# EAGLE design display_board_ATMega4809 (EAGLE 9.6.2)
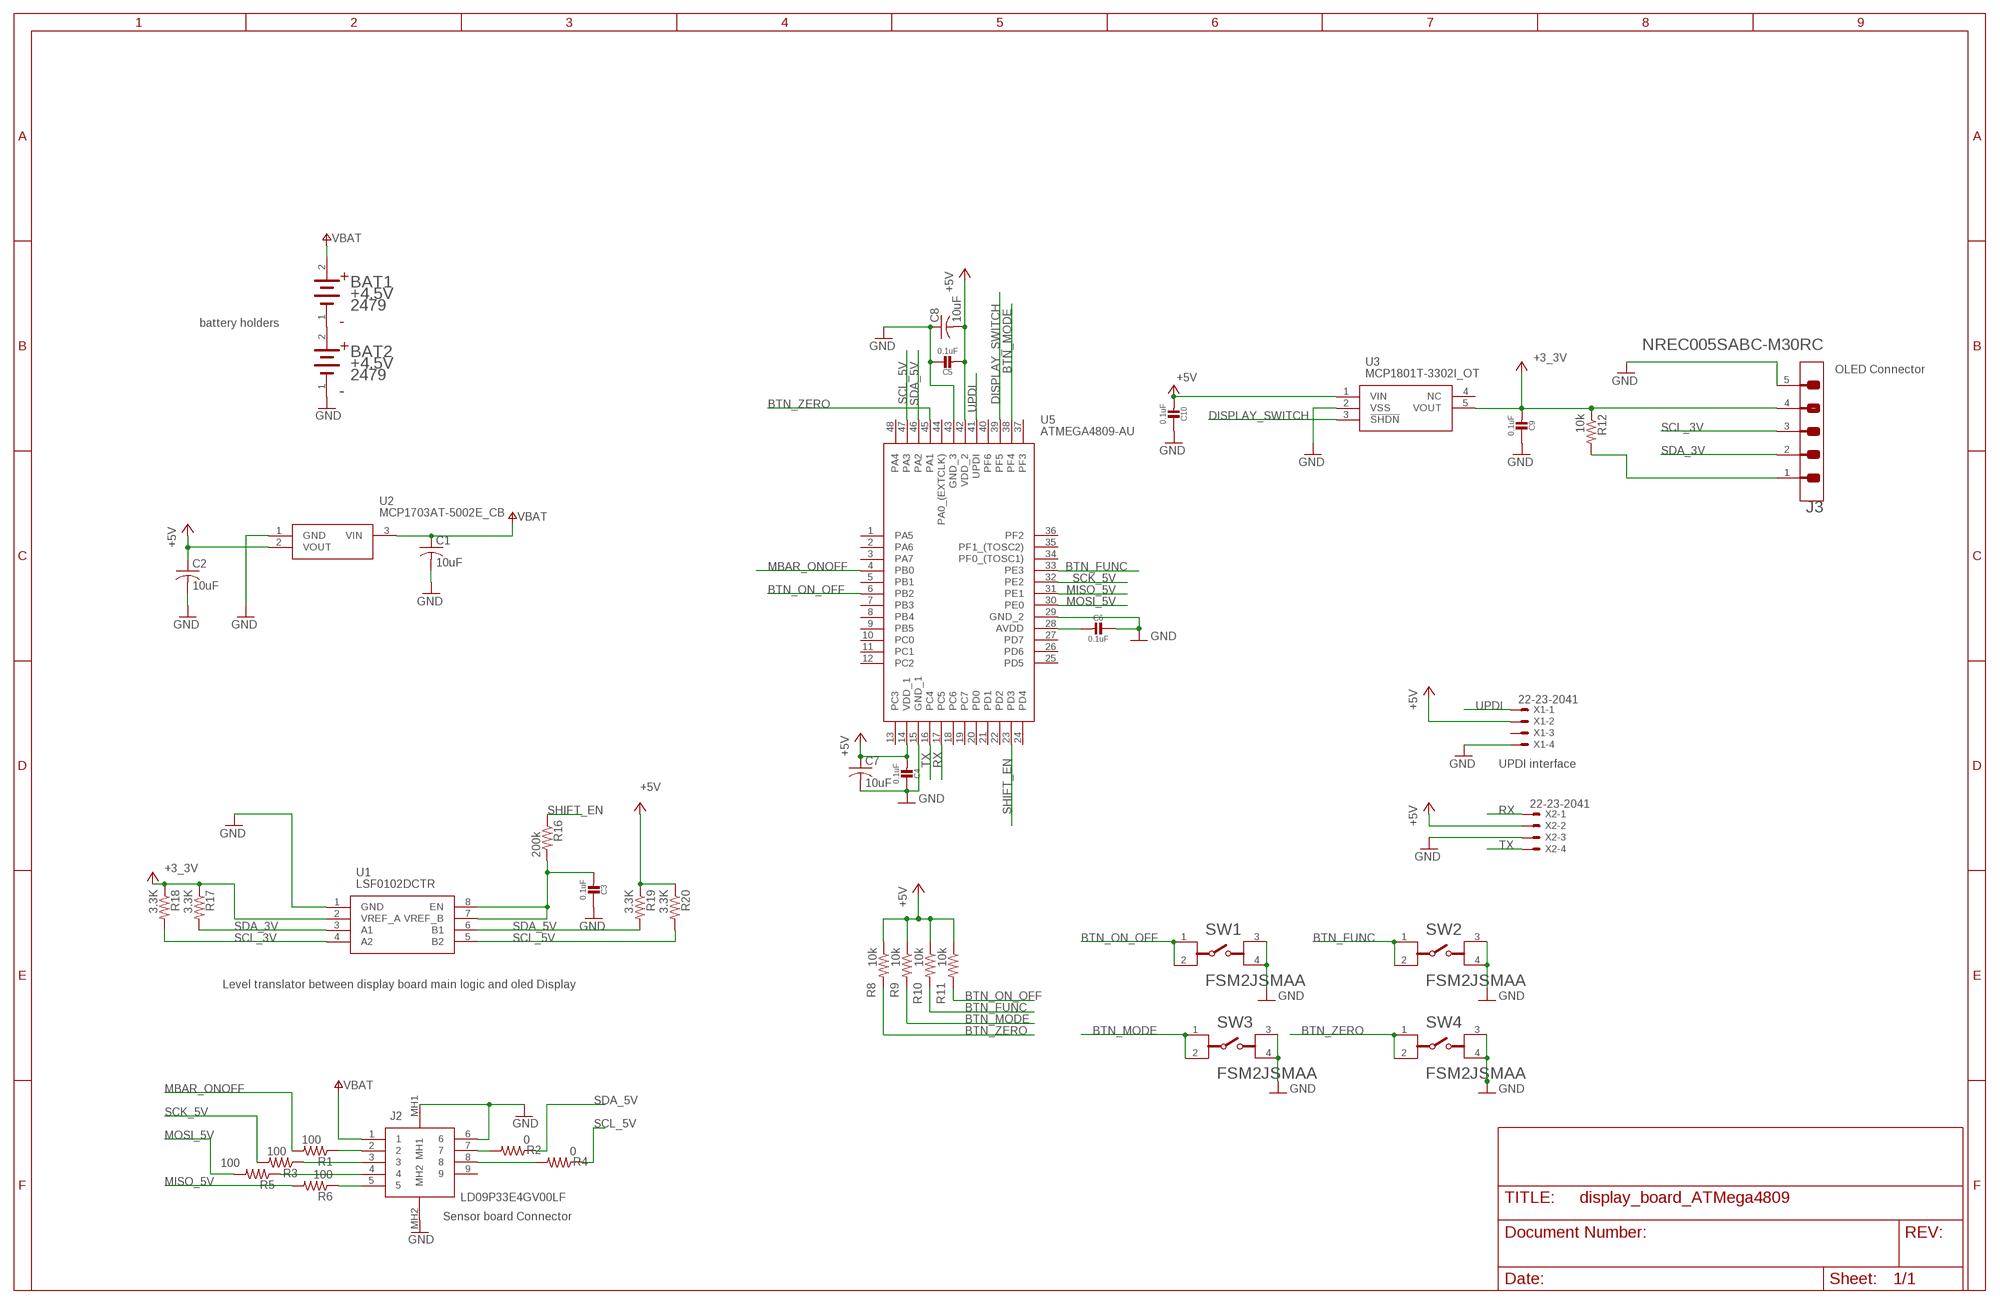
[diagram p0: schematic, sheet 1]

## Parts
BAT1  KEYSTONE_2479KEYSTONE_2479_0_0  [KEYSTONE_2479_0]
BAT2  KEYSTONE_2479KEYSTONE_2479_0_0  [KEYSTONE_2479_0]
C1  10uF  C-USC0805  [C0805]
C2  10uF  C-USC0805  [C0805]
C3  0.1uF  CAP_CERAMIC_0603MP  [_0603MP]
C4  0.1uF  CAP_CERAMIC_0603MP  [_0603MP]
C5  0.1uF  CAP_CERAMIC_0603MP  [_0603MP]
C6  0.1uF  CAP_CERAMIC_0603MP  [_0603MP]
C7  10uF  C-USC0805  [C0805]
C8  10uF  C-USC0805  [C0805]
C9  0.1uF  CAP_CERAMIC_0603MP  [_0603MP]
C10  0.1uF  CAP_CERAMIC_0603MP  [_0603MP]
J2  LD09P33E4GV00LF  [LD09P33E4GV00LF]
J3  SULLINS_NREC005SABC-M30RCSULLINS_NREC005SABC-M30RC_0_0  [SULLINS_NREC005SABC-M30RC_0]
R1  100  R-US_R0603  [R0603]
R2  0  R-US_R0603  [R0603]
R3  100  R-US_R0603  [R0603]
R4  0  R-US_R0603  [R0603]
R5  100  R-US_R0603  [R0603]
R6  100  R-US_R0603  [R0603]
R8  10k  R-US_R0603  [R0603]
R9  10k  R-US_R0603  [R0603]
R10  10k  R-US_R0603  [R0603]
R11  10k  R-US_R0603  [R0603]
R12  10k  R-US_R0603  [R0603]
R16  200k  R-US_R0603  [R0603]
R17  3.3K  R-US_R0603  [R0603]
R18  3.3K  R-US_R0603  [R0603]
R19  3.3K  R-US_R0603  [R0603]
R20  3.3K  R-US_R0603  [R0603]
SW1  TE_CONNECTIVITY_FSM2JSMAATE_CONNECTIVITY_FSM2JSMAA_0_0  [TE_CONNECTIVITY_FSM2JSMAA_0]
SW2  TE_CONNECTIVITY_FSM2JSMAATE_CONNECTIVITY_FSM2JSMAA_0_0  [TE_CONNECTIVITY_FSM2JSMAA_0]
SW3  TE_CONNECTIVITY_FSM2JSMAATE_CONNECTIVITY_FSM2JSMAA_0_0  [TE_CONNECTIVITY_FSM2JSMAA_0]
SW4  TE_CONNECTIVITY_FSM2JSMAATE_CONNECTIVITY_FSM2JSMAA_0_0  [TE_CONNECTIVITY_FSM2JSMAA_0]
U1  LSF0102DCTR  [SOP65P400X130-8N]
U2  MCP1703AT-5002E_CB  [SOT95P255X145-3N]
U3  MCP1801T-3302I_OT  [SOT95P270X145-5N]
U5  ATMEGA4809-AU  [QFP50P900X900X120-48N]
X1  22-23-2041  [22-23-2041]
X2  22-23-2041  [22-23-2041]

## Nets
+3V3: C9.2 J3.4 R12.1 R17.1 R18.1 U1.2(VREF_A) U3.5(VOUT) ; supply symbol labelled +3_3V
+5V: C2.1 C4.2 C5.2 C7.1 C8.2 C10.2 R8.1 R9.1 R10.1 R11.1 R19.1 R20.1 U2.2(VOUT) U3.1(VIN) U5.14(VDD_1) U5.42(VDD_2) X1.2 X2.2
BTN_FUNC: R10.2 SW2.1 SW2.2 U5.33(PE3)
BTN_MODE: R9.2 SW3.1 SW3.2 U5.38(PF4)
BTN_ON_OFF: R11.2 SW1.1 SW1.2 U5.6(PB2)
BTN_ZERO: R8.2 SW4.1 SW4.2 U5.45(PA1)
DISPLAY_RESET: J3.1 R12.2
DISPLAY_SWITCH: U3.3(!SHDN) U5.39(PF5)
GND: BAT2.1(CATHODE) C1.2 C2.2 C3.1 C4.1 C5.1 C6.1 C7.2 C8.1 C9.1 C10.1 J2.6 J2.MH1 J2.MH2 J3.5 SW1.3 SW1.4 SW2.3 SW2.4 SW3.3 SW3.4 SW4.3 SW4.4 U1.1(GND) U2.1(GND) U3.2(VSS) U5.15(GND_1) U5.29(GND_2) U5.43(GND_3) X1.4 X2.3
MBAR_ONOFF: R1.2 U5.4(PB0)
MISO_5V: R6.2 U5.31(PE1)
MOSI_5V: R5.2 U5.30(PE0)
N$1: C3.2 R16.2 U1.7(VREF_B) U1.8(EN)
N$2: J2.2 R1.1
N$4: J2.3 R3.1
N$5: J2.7 R2.2
N$7: J2.4 R5.1
N$8: J2.5 R6.1
N$9: C6.2 U5.28(AVDD)
N$11: J2.8 R4.2
N$16: BAT1.1(CATHODE) BAT2.2(ANODE)
RX: U5.17(PC5) X2.1
SCK_5V: R3.2 U5.32(PE2)
SCL_3V: J3.3 R18.2 U1.4(A2)
SCL_5V: R4.1 R20.2 U1.5(B2) U5.47(PA3)
SDA_3V: J3.2 R17.2 U1.3(A1)
SDA_5V: R2.1 R19.2 U1.6(B1) U5.46(PA2)
SHIFT_EN: R16.1 U5.23(PD3)
TX: U5.16(PC4) X2.4
UPDI: U5.41(UPDI) X1.1
VBAT: BAT1.2(ANODE) C1.1 J2.1 U2.3(VIN)
Unconnected: J2.9 U3.4(NC) U5.1(PA5) U5.2(PA6) U5.3(PA7) U5.5(PB1) U5.7(PB3) U5.8(PB4) U5.9(PB5) U5.10(PC0) U5.11(PC1) U5.12(PC2) U5.13(PC3) U5.18(PC6) U5.19(PC7) U5.20(PD0) U5.21(PD1) U5.22(PD2) U5.24(PD4) U5.25(PD5) U5.26(PD6) U5.27(PD7) U5.34(PF0_(TOSC1)) U5.35(PF1_(TOSC2)) U5.36(PF2) U5.37(PF3) U5.40(PF6) U5.44(PA0_(EXTCLK)) U5.48(PA4) X1.3

## Notes on the sheet
- battery holders
- OLED Connector
- UPDI interface
- Level translator between display board main logic and oled Display
- Sensor board Connector

## Library data of the parts
BAT1 BAT2 = Keystone - 2479:KEYSTONE_2479: PC BATTERY HOLDER (3) 'AAA'; CENTROID_NOT_SPECIFIED: No; DATASHEET: http://www.keyelco.com/product-pdf.cfm?p=1041; DIGIKEY_DESCRIPTION: UNK HOLDER BATTERY 3CELL AAA PC MNT; DIGIKEY_PART_NUMBER: 36-2479-ND; LEAD_FREE: yes; MF: Keystone; MOUNTING_TYPE: PCB, Through Hole; MOUSER_PART_NUMBER: 534-2479; MPN: 2479; PACKAGE: CONN_BAT_HOLDER_3_AAA; PREFIX: BAT; ROHS: yes
C1 C2 C7 C8 = adafruit:C-US: CAPACITOR, American symbol
C3-C6 C9 C10 = microbuilder:CAP_CERAMIC: Ceramic Capacitors For new designs, use the packages preceded by an '_' character since they are more reliable: The following footprints should be used on most boards: _0402 - Standard footprint for regular board layouts _0603 - Standard footprint for regular board layouts _0805 - Standard footprint for regular board layouts _1206 - Standard footprint for regular board layouts For extremely tight-pitch boards where space is at a premium, the following 'micro-pitch' footprints can be used (smaller pads, no silkscreen outline, etc.): _0402MP - Micro-pitch footprint for very dense/compact boards _0603MP - Micro-pitch footprint for very dense/compact boards _0805MP - Micro-pitch footprint for very dense/compact boards _1206MP - Micro-pitch footprint for very dense/compact boards
J2 = SamacSys_Parts:LD09P33E4GV00LF: D-Sub Standard Connectors DSub R/A STB 9 Pin LF Source: Datasheet <https://www.mouser.mx/datasheet/2/18/10130914-1362388.pdf>; ARROW_PART_NUMBER: LD09P33E4GV00LF; ARROW_PRICE-STOCK: https://www.arrow.com/en/products/ld09p33e4gv00lf/amphenol-fci; DESCRIPTION: D-Sub Standard Connectors DSub R/A STB 9 Pin LF; HEIGHT: 12.96mm; MANUFACTURER_NAME: Amphenol; MANUFACTURER_PART_NUMBER: LD09P33E4GV00LF; MOUSER_PART_NUMBER: 649-LD09P33E4GV00LF; MOUSER_PRICE-STOCK: https://www.mouser.co.uk/ProductDetail/Amphenol-FCI/LD09P33E4GV00LF?qs=tZOhSuJQg1nNyHdnl62Ffg%3D%3D
J3 = Sullins - NREC005SABC-M30RC:SULLINS_NREC005SABC-M30RC: HEADER MALE .100"[2.54mm]PITCH, SM; CENTROID_NOT_SPECIFIED: No; DATASHEET: http://media.digikey.com/PDF/Data%20Sheets/Sullins%20PDFs/xRxCzzzSzzz-M30RC_11657-B.pdf; DIGIKEY_DESCRIPTION: CONN S1013EC-05-ND; DIGIKEY_PART_NUMBER: CONN HEADER .100" SNGL SMD 5POS; LEAD_FREE: yes; MF: Sullins; MPN: NREC005SABC-M30RC; PACKAGE: HDR5; PREFIX: J; ROHS: yes; TEMPERATURE_RANGE_HIGH: +105°C; TEMPERATURE_RANGE_LOW: -40°C
R1-R6 R8-R12 R16-R20 = adafruit:R-US_: RESISTOR, American symbol
SW1-SW4 = TE Connectivity - FSM2JSMAA:TE_CONNECTIVITY_FSM2JSMAA: SWITCH TACTILE SPST-NO 0.05A 24V; AUTOMOTIVE: No; CENTROID_NOT_SPECIFIED: No; CONTACT_CURRENT_RATING: 50mA; CONTACT_RESISTANCE: 100mΩ; DATASHEET: https://www.te.com/commerce/DocumentDelivery/DDEController?Action=showdoc&DocId=Customer+Drawing%7F2-1437565-7%7FV%7Fpdf%7FEnglish%7FENG_CD_2-1437565-7_V.pdf%7F2-1437565-8; DEVICE_CLASS_L1: Electromechanical; DEVICE_CLASS_L2: Switches; DEVICE_CLASS_L3: Pushbutton Switches; DIGIKEY_DESCRIPTION: SWITCH TACTILE SPST-NO 0.05A 24V; DIGIKEY_PART_NUMBER: 450-3355-ND; ELECTROMECHANICAL_LIFE: 100000Cycles; FOOTPRINT_VARIANT_NAME_0: Recommended_Land_Pattern; HEIGHT: 4.59mm; LEAD_FREE: Yes; MF: TE Connectivity; MFG_PACKAGE_IDENT: 0; MFG_PACKAGE_IDENT_DATE: 0; MFG_PACKAGE_IDENT_REV: 0; MOUNT: Surface Mount; MOUSER_DESCRIPTION: Tactile Switches TACTILE 260G FORCE S; MOUSER_PART_NUMBER: 506-2-1437565-8; MPN: FSM2JSMAA; OPERATING_FORCE: 260gf; PACKAGE: SMT_SW_6MM00_6MM00; PREFIX: SW; ROHS: Yes; STANDOFF_HEIGHT: 0.05mm; TEMPERATURE_RANGE_HIGH: +85°C; TEMPERATURE_RANGE_LOW: -35°C; THROW_CONFIGURATION: SPST-NO; VERIFICATION_VERSION: 0.0.0.3; VOLTAGE_RATING_DC: 24V
U1 = SamacSys_Parts:LSF0102DCTR: Translation - Voltage Levels Dual Bidirect Multi VTG Level Translator Source: Datasheet <http://www.mouser.com/ds/2/405/lsf0102-485534.pdf>; ARROW_PART_NUMBER: LSF0102DCTR; ARROW_PRICE-STOCK: https://www.arrow.com/en/products/lsf0102dctr/texas-instruments?region=nac; DESCRIPTION: Translation - Voltage Levels Dual Bidirect Multi VTG Level Translator; HEIGHT: 1.3mm; MANUFACTURER_NAME: Texas Instruments; MANUFACTURER_PART_NUMBER: LSF0102DCTR; MOUSER_PART_NUMBER: 595-LSF0102DCTR; MOUSER_PRICE-STOCK: https://www.mouser.co.uk/ProductDetail/Texas-Instruments/LSF0102DCTR?qs=%2Fd%252BFzHvH4c0QgjSN7tA2YQ%3D%3D
U2 = SamacSys_Parts:MCP1703AT-5002E_CB: LDO Low Iq 250mA 16V 5.0V 2% SOT23A Microchip MCP1703AT-5002E/CB, LDO Voltage Regulator, 250mA, 5 V 2%, 2.7 16 Vin, 3-Pin SOT-23A Source: Datasheet <http://uk.rs-online.com/web/p/products/7709511>; ARROW_PART_NUMBER: MCP1703AT-5002E/CB; ARROW_PRICE-STOCK: https://www.arrow.com/en/products/mcp1703at-5002ecb/microchip-technology?region=nac; DESCRIPTION: LDO Low Iq 250mA 16V 5.0V 2% SOT23A Microchip MCP1703AT-5002E/CB, LDO Voltage Regulator, 250mA, 5 V 2%, 2.7 16 Vin, 3-Pin SOT-23A; HEIGHT: 1.45mm; MANUFACTURER_NAME: Microchip; MANUFACTURER_PART_NUMBER: MCP1703AT-5002E/CB; MOUSER_PART_NUMBER: 579-MCP1703AT5002ECB; MOUSER_PRICE-STOCK: https://www.mouser.co.uk/ProductDetail/Microchip-Technology/MCP1703AT-5002E-CB?qs=PZkJWYMe7lfGlNu7PCEqfg%3D%3D
U3 = SamacSys_Parts:MCP1801T-3302I_OT: LDO Regulator 150mA 3.3V PSRR SOT23-5 Source: Datasheet <http://ww1.microchip.com/downloads/en/DeviceDoc/22051D.pdf>; ARROW_PART_NUMBER: MCP1801T-3302I/OT; ARROW_PRICE-STOCK: https://www.arrow.com/en/products/mcp1801t-3302iot/microchip-technology?region=nac; DESCRIPTION: LDO Regulator 150mA 3.3V PSRR SOT23-5; HEIGHT: 1.45mm; MANUFACTURER_NAME: Microchip; MANUFACTURER_PART_NUMBER: MCP1801T-3302I/OT; MOUSER_PART_NUMBER: 579-MCP1801T-3302IOT; MOUSER_PRICE-STOCK: https://www.mouser.co.uk/ProductDetail/Microchip-Technology/MCP1801T-3302I-OT?qs=aE5D7Pt6ky2SR1F7p8712g%3D%3D
U5 = SamacSys_Parts:ATMEGA4809-AU: 8-bit Microcontrollers - MCU 20MHz, 48KB, TQFP Source: Datasheet <https://www.mouser.com/datasheet/2/268/48-pin-Data-Sheet-megaAVR-0-series-DS40002016B-1550806.pdf>; ARROW_PART_NUMBER: ATMEGA4809-AU; ARROW_PRICE-STOCK: https://www.arrow.com/en/products/atmega4809-au/microchip-technology?region=nac; DESCRIPTION: 8-bit Microcontrollers - MCU 20MHz, 48KB, TQFP; HEIGHT: 1.2mm; MANUFACTURER_NAME: Microchip; MANUFACTURER_PART_NUMBER: ATMEGA4809-AU; MOUSER_PART_NUMBER: 556-ATMEGA4809-AU; MOUSER_PRICE-STOCK: https://www.mouser.co.uk/ProductDetail/Microchip-Technology-Atmel/ATMEGA4809-AU?qs=P1JMDcb91o4zLIorxO9tIg%3D%3D
X1 X2 = con-molex:22-23-2041: .100" (2.54mm) Center Header - 4 Pin; MF: MOLEX; MPN: 22-23-2041; OC_FARNELL: 1462920; OC_NEWARK: 38C0355

## Board
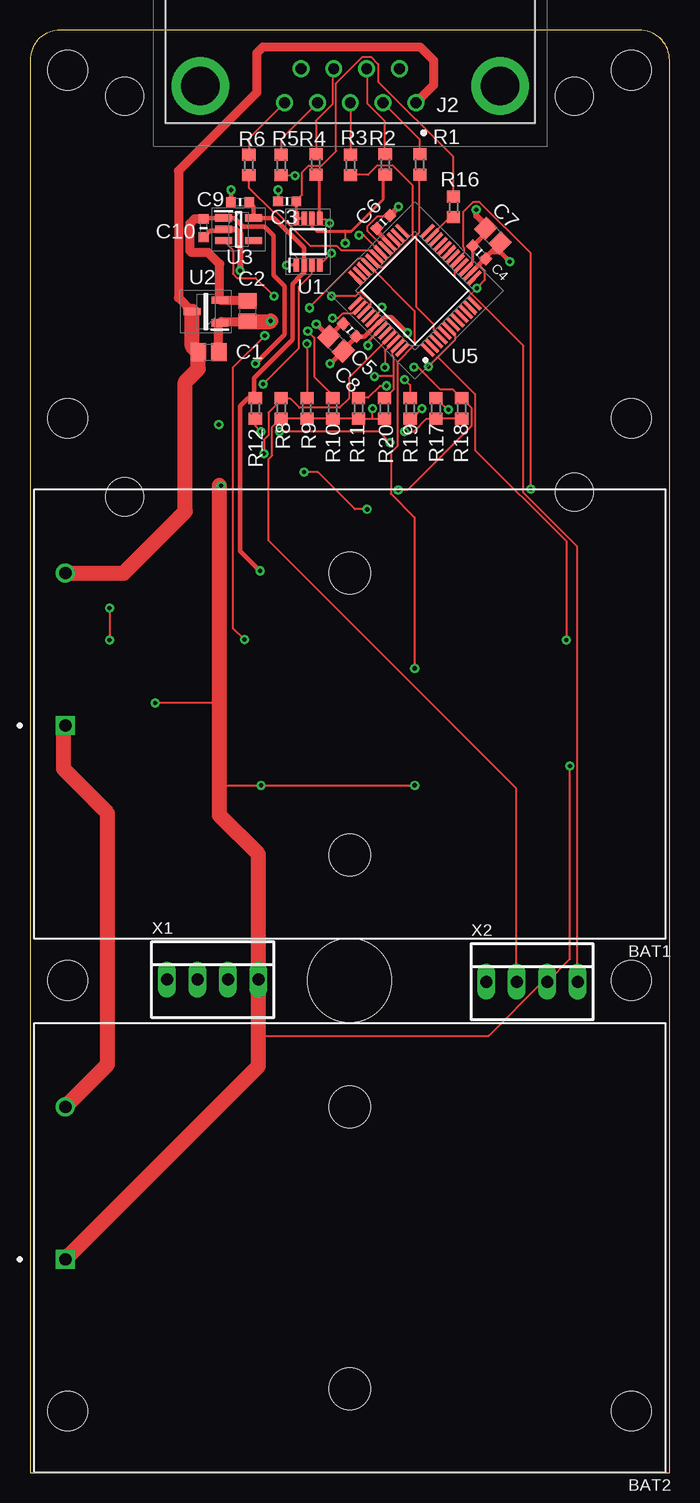
[diagram p1: board, top side]
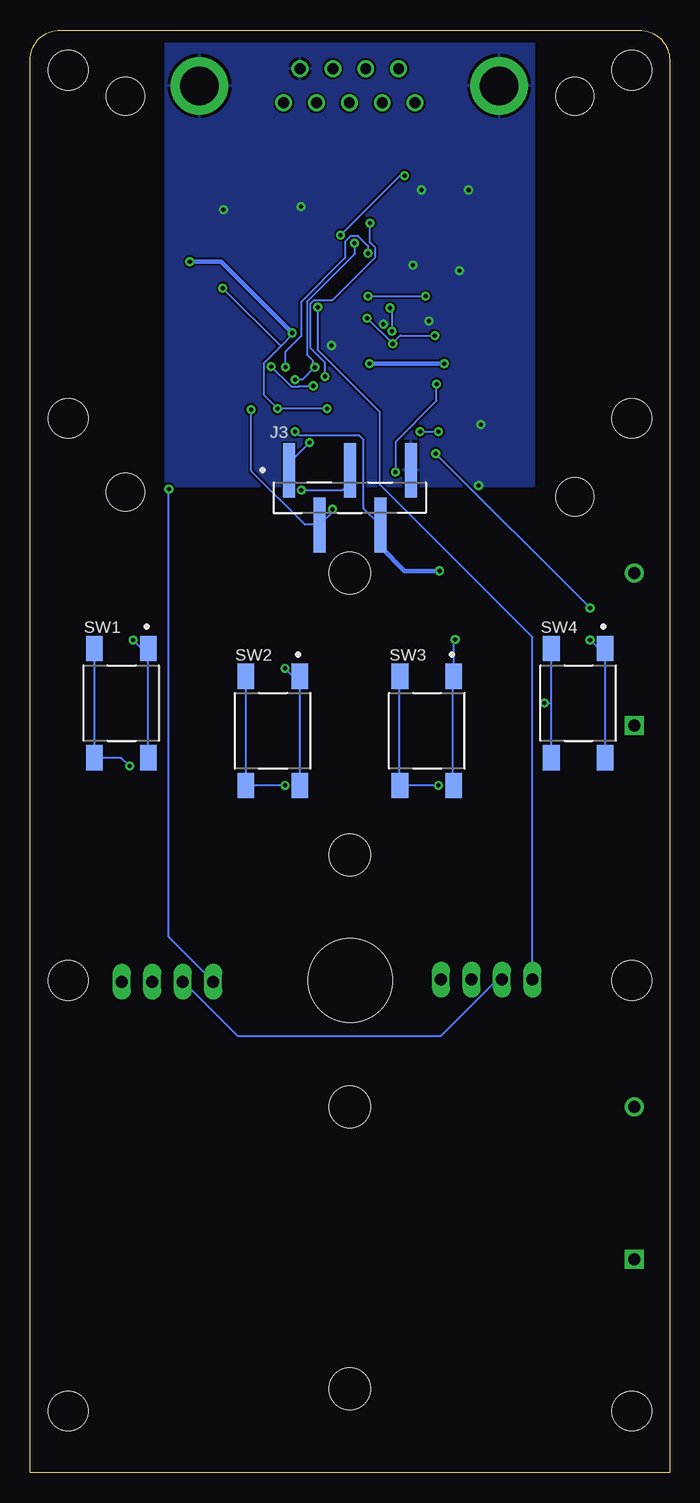
[diagram p2: board, bottom side, seen from below]

Size 53.34 x 120.27 mm. Coordinates in mm from the lower left corner, seen from the top.
Outline: 0,0 53.34,0 53.34,117.73 arc90 50.8,120.27 2.54,120.27 arc90 0,117.73 0,0
Copper layers (1*16): Top 0.035mm / dielectric 1.5mm / Bottom 0.035mm
Design rules "default": minimum track width 6mil, minimum drill 0.35mm, track to track 6mil, track to pad 6mil, pad to pad 6mil, via to via 6mil, smd to smd 6mil, copper to edge 40mil, drill to drill 6mil, minimum pad ring 10mil, minimum via ring 8mil, stop-mask expansion 4mil, vias tented up to drill 0mil, thermal gap 10mil
Holes 3.3 mm at 3.15,5.14 50.14,5.14 3.15,41.03 50.14,41.03 3.15,87.9 50.14,87.9 50.14,116.9 3.15,116.9
Holes 3.17 mm at 7.9,114.74 7.9,81.34 45.39,114.74 45.39,81.75
Holes 7.01 mm at 26.64,41.03

### Footprints (pad centres in the part's own frame; a part is rotated, then mirrored left to right if it is on the bottom)
KEYSTONE_2479_0 = drill 1.02 pad 1.57 square: 1 23.72,0.95 | drill 1.02 pad 1.57: 2 23.72,-11.75 | hole 3.45: 0,11.75; 0,-11.75
C0805 = smd 1.3 x 1.5: 1 -0.85,0; 2 0.85,0
_0603MP = smd 0.8 x 0.8: 1 -0.762,0; 2 0.762,0
LD09P33E4GV00LF = drill 0.9 pad 1.4: 1 0,0; 2 2.74,0; 3 5.48,0; 4 8.22,0; 5 10.96,0; 6 1.37,-2.84; 7 4.11,-2.84; 8 6.85,-2.84; 9 9.59,-2.84 | drill 3.2 pad 4.8: MH1 -7.015,-1.42; MH2 17.975,-1.42
SULLINS_NREC005SABC-M30RC_0 = smd 1 x 4.565: 1 -5.08,2.282; 2 -2.54,-2.282; 3 0,2.282; 4 2.54,-2.282; 5 5.08,2.282
R0603 = smd 1 x 1.1: 1 -0.85,0; 2 0.85,0
TE_CONNECTIVITY_FSM2JSMAA_0 = smd 1.38 x 2.1: 1 2.25,4.55; 2 2.24,-4.55; 3 -2.24,4.55; 4 -2.24,-4.55
SOP65P400X130-8N = smd 1.1 x 0.45: 1 -1.95,0.975; 2 -1.95,0.325; 3 -1.95,-0.325; 4 -1.95,-0.975; 5 1.95,-0.975; 6 1.95,-0.325; 7 1.95,0.325; 8 1.95,0.975
SOT95P255X145-3N = smd 1.4 x 0.6: 1 -1.15,0.95; 2 -1.15,-0.95; 3 1.15,0
SOT95P270X145-5N = smd 1.4 x 0.6: 1 -1.25,0.95; 2 -1.25,0; 3 -1.25,-0.95; 4 1.25,-0.95; 5 1.25,0.95
QFP50P900X900X120-48N = smd 1.475 x 0.3: 1 -4.238,2.75; 2 -4.238,2.25; 3 -4.238,1.75; 4 -4.238,1.25; 5 -4.238,0.75; 6 -4.238,0.25; 7 -4.238,-0.25; 8 -4.238,-0.75; 9 -4.238,-1.25; 10 -4.238,-1.75; 11 -4.238,-2.25; 12 -4.238,-2.75; 25 4.238,-2.75; 26 4.238,-2.25; 27 4.238,-1.75; 28 4.238,-1.25; 29 4.238,-0.75; 30 4.238,-0.25; 31 4.238,0.25; 32 4.238,0.75; 33 4.238,1.25; 34 4.238,1.75; 35 4.238,2.25; 36 4.238,2.75 | smd 0.3 x 1.475: 13 -2.75,-4.238; 14 -2.25,-4.238; 15 -1.75,-4.238; 16 -1.25,-4.238; 17 -0.75,-4.238; 18 -0.25,-4.238; 19 0.25,-4.238; 20 0.75,-4.238; 21 1.25,-4.238; 22 1.75,-4.238; 23 2.25,-4.238; 24 2.75,-4.238; 37 2.75,4.238; 38 2.25,4.238; 39 1.75,4.238; 40 1.25,4.238; 41 0.75,4.238; 42 0.25,4.238; 43 -0.25,4.238; 44 -0.75,4.238; 45 -1.25,4.238; 46 -1.75,4.238; 47 -2.25,4.238; 48 -2.75,4.238
22-23-2041 = drill 1 long: 1 -3.81,0; 2 -1.27,0; 3 1.27,0; 4 3.81,0

### Placement (x,y rotation side)
BAT1  26.67,63.25 180 top
BAT2  26.67,18.75 180 top
C1  14.88,93.41 0 top
C2  18.15,96.82 270 top
C3  21.45,105.98 0 top
C4  37.47,101.73 315 top
C5  26.67,95.25 315 top
C6  29.46,104.27 225 top
C7  38.61,103.12 135 top
C8  25.53,94.11 315 top
C9  17.53,105.92 0 top
C10  14.48,103.76 90 top
J2  32.19,114.2 180 top
J3  26.67,81.28 0 bottom
R1  32.51,109.05 270 top
R2  29.62,109.05 90 top
R3  26.73,109.01 270 top
R4  23.85,109.05 90 top
R5  20.95,109.01 270 top
R6  18.25,109.01 270 top
R8  20.95,88.72 90 top
R9  23.1,88.72 90 top
R10  25.25,88.72 90 top
R11  27.4,88.72 90 top
R12  18.8,88.72 270 top
R16  35.32,105.51 90 top
R17  33.85,88.72 90 top
R18  36,88.72 90 top
R19  31.7,88.72 90 top
R20  29.55,88.72 90 top
SW1  45.72,64.16 0 bottom
SW2  33.1,61.85 0 bottom
SW3  20.24,61.85 0 bottom
SW4  7.62,64.16 0 bottom
U1  23.19,102.62 90 top
U2  14.68,96.8 180 top
U3  17.4,103.64 0 top
U5  32.11,98.55 135 top
X1  15.24,41.11 0 top
X2  41.87,40.93 0 top

### Tracks (layer width: path | path; a pad name or v marks a point on that pad's centre or on a via)
+3V3  (via drill 0.35)
  Top 0.152: R18.1 35.97,87.86 33.91,87.86 R17.1 33.83,87.86 33.07,87.86 32,86.79 v31.24,86.79
  Top 0.381: v19.18,75.18 17.53,76.83 17.53,88.9 18.19,89.57 R12.1 18.67,89.69 18.67,91.23 21.88,94.44 21.88,99.1 22.56,99.77 22.58,99.77 22.86,100.06 U1.2 22.86,102.1 20.37,104.59 U3.5 18.65,105.56 C9.2
  Bottom 0.152: v31.24,86.79 30.94,86.49 25.91,86.49 25.53,86.11 25.53,80.39 24.16,79.02 J3.4
  Bottom 0.381: v19.18,75.18 22.1,75.18 24.13,77.22 J3.4
+5V  (via drill 0.35)
  Top 0.152: U5.42 28.88,95.71 28.5,95.33 28.45,95.25 | 28.57,87.86 27.43,87.86 R11.1 27.36,87.86 25.3,87.86 R10.1 25.22,87.86 23.16,87.86 R9.1 23.09,87.86 20.95,87.86 R8.1 20.88,87.86 20.19,87.17 20.19,84.79 19.89,84.49 19.89,77.72 40.54,57.07 40.54,41 X2.2 | 28.57,87.86 29.49,87.86 R20.1 | v32.69,88.7 31.93,87.94 31.77,87.94 R19.1 | 28.57,87.86 v28.57,88.7 | 31.43,95.06 v31.47,95.02 | v37.26,98.75 37.95,99.44 37.95,100.2 37.57,100.58 37.44,100.71 | 16.46,104.39 U3.1
  Top 0.381: 28.45,95.25 27.91,94.71 C5.2 26.13,93.63 C8.2 25.08,92.46 v25.02,92.46 | U5.14 37.44,100.71 37.92,101.19 C4.2 38,101.32 38.45,101.76 | 38.45,101.76 C7.1 | v40.01,100.97 39.21,101.76 38.45,101.76 | U5.42 28.94,95.73 29.56,96.35 30.14,96.35 31.43,95.06 | v18.8,92.46 21.21,94.87 21.21,98.93 20.32,99.82 20.32,103.12 19.56,103.89 17.78,103.89 17.07,104.59 U3.1 14.55,104.59 C10.2
  Top 0.762: C2.1 18.07,97.75 U2.2 15.83,100.75 14.86,101.73 13.46,101.73 13.34,101.85 13.34,104.14 13.72,104.52 C10.2
  Bottom 0.152: X1.2 14.02,41.07 14.4,41.07 19.05,36.42 36.04,36.42 40.54,40.92 X2.2 | v28.57,88.7 v32.69,88.7 33.83,89.84 33.83,92.51 32.42,93.92 | v31.47,95.02 31.47,94.87 32.42,93.92 | 32.42,93.92 v37.26,98.75
  Bottom 0.381: v31.47,95.02 37.41,100.97 v40.01,100.97 | v18.8,92.46 v25.02,92.46
BTN_FUNC  (via drill 0.35)
  Top 0.152: v23.16,95.17 23.7,94.64 23.7,91.36 25.22,89.84 25.22,89.61 R10.2 | v23.32,97.1 23.32,97.16 27.36,101.19 27.74,101.19 28.19,100.74 U5.33 28.27,100.66 32.08,96.85 32.08,94.03 30.63,92.58 30.63,85.57 30.1,85.04 30.1,81.61 32.08,79.63 v32.08,67.06
  Bottom 0.152: SW2.2 30.86,66.37 SW2.1 30.94,66.37 31.39,66.37 v32.08,67.06 | v23.32,97.1 23.16,96.95 v23.16,95.17
BTN_MODE  (via drill 0.35)
  Top 0.152: v23.09,94.11 23.09,89.61 R9.2 | v25.22,96.24 25.68,96.24 26.06,96.62 27.05,96.62 27.51,97.08 U5.38 | v17.88,69.47 16.92,70.43 16.92,92.13 v19.58,94.79
  Bottom 0.152: SW3.2 18.06,57.3 18.06,66.37 SW3.1 17.99,69.36 v17.88,69.47 | v25.22,96.24 v23.09,94.11 23.09,94.18 22.48,94.79 v19.58,94.79
BTN_ON_OFF  (via drill 0.35)
  Top 0.152: v29.72,90.6 29.18,90.6 28.19,89.61 27.43,89.61 R11.2 | 34.02,93 35.43,94.41 35.43,94.87 34.98,95.33 U5.6 | 34.02,93 v33.22,92.2 | v44.73,69.42 44.73,77.65 37.11,85.27 37.11,89.92 34.02,93
  Bottom 0.152: SW1.2 43.51,59.66 43.51,68.66 SW1.1 43.59,68.66 43.97,68.66 v44.73,69.42 | v29.72,90.6 30.86,90.6 30.94,90.53 31.55,90.53 v33.22,92.2
BTN_ZERO  (via drill 0.35)
  Top 0.152: U5.45 29.95,94.64 26.59,91.29 26.59,89.53 25.83,88.77 22.48,88.77 21.72,89.53 20.95,89.53 R8.2 20.95,89.46 19.89,88.39 19.89,86.49 19.51,86.11 v19.51,84.96 | v6.63,72.08 v6.63,69.42
  Bottom 0.152: SW4.2 5.41,59.66 5.41,68.66 SW4.1 5.49,68.66 5.87,68.66 v6.63,69.42 | v19.51,84.96 v6.63,72.08
DISPLAY_RESET  (via drill 0.35)
  Top 0.152: v19.28,86.79 18.82,87.25 18.82,87.86 R12.2 | v20.8,86.79 29.11,86.79 v30.02,85.88
  Bottom 0.152: v20.8,86.79 v19.28,86.79 | v30.02,85.88 31.7,84.2 31.7,83.59 J3.1
DISPLAY_SWITCH  (via drill 0.35)
  Top 0.152: v25.15,98.07 27.13,98.07 27.43,98.37 27.66,98.37 28.42,97.61 28.42,97.38 27.89,96.85 U5.39 | v20.34,98.07 18.82,99.59 17.28,99.59 16.92,99.95 16.92,101.92 U3.3
  Bottom 0.152: v25.15,98.07 v20.34,98.07
GND  (via drill 0.35)
  Top 0.152: v21.41,100.66 22.17,100.66 | v15.93,82.3 15.81,82.3 | 15.62,103.56 15.75,103.56 16.08,103.56 U3.2 | 24.84,94.56 C8.1 | U5.29 29.57,102.11 28.12,103.56 28.12,103.86 28.96,104.7 29.79,104.7 C6.1 | 19.05,36.42 38.25,36.42 42.75,40.92 43.13,40.92 X2.3 45.03,42.82 v45.03,58.9 | 15.81,64.16 v10.44,64.16 | 15.81,57.3 v19.28,57.3 v32.08,57.3
  Top 0.254: 16.16,103.63 U3.2 | v20.7,106.93 20.7,105.99 C3.1 | U5.15 36.96,100.93 36.96,102.23 C4.1 | U1.1 22.21,100.66 v21.41,100.66 | U5.43 28.19,94.29 v28.19,93.98
  Top 0.381: C4.1 38.01,103.35 C7.2 | C8.1 26.01,95.79 C5.1 | C8.1 | C8.1 v23.88,95.76 | C10.1 15.04,103.56 15.75,103.56 | C9.1 v16.76,106.93
  Top 0.508: C6.1 v30.73,105.54 | C7.2 38.01,103.98 37.21,104.78 v37.21,105.28 | U3.2 17.18,103.64 17.53,103.3 v17.53,100.2 17.53,100.08
  Top 0.762: C1.2 15.73,95.75 U2.1 15.96,95.97 C2.2
  Top 1.27: BAT2.1 19.05,33.9 19.05,36.42 X1.4 19.05,51.56 15.81,54.8 15.81,57.3 15.81,64.16 15.81,82.3 | C2.2 20.03,95.97 v20.07,96.01
  Bottom 0.152: SW1.3 48.01,68.66 48.01,59.66 SW1.4 47.93,59.59 45.72,59.59 v45.03,58.9 | SW2.3 35.36,66.37 35.36,57.3 SW2.4 35.28,57.3 v32.08,57.3 | SW3.3 22.55,66.37 22.55,57.3 SW3.4 v19.28,57.3 | 9.91,64.16 9.91,68.66 SW4.3 | 9.91,64.16 9.91,59.66 SW4.4 | v10.44,64.16 9.91,64.16
  other vias: 15.75,87.38
  pour Bottom: 11.3,120.02 42.04,120.02 42.04,82.3 11.3,82.3
MBAR_ONOFF
  Top 0.152: R1.2 32.46,108.13 32.46,103.4 32.23,103.17 32.23,97.16 33.68,95.71 33.68,95.25 34.21,94.72 U5.4
MISO_5V
  Top 0.152: R6.2 18.29,108.13 18.29,107.09 20.3,105.08 20.57,105.08 23.39,102.26 25.6,102.26 25.98,101.88 28.42,101.88 28.88,101.42 U5.31
MOSI_5V  (via drill 0.35)
  Top 0.152: v22.1,108.13 20.95,108.13 R5.2 | v27.43,103.17 27.81,103.17 29.26,101.73 U5.30
  Bottom 0.152: v22.1,108.13 22.48,108.13 v27.43,103.17
N$1
  Top 0.152: R16.2 35.28,106.38 35.28,109.73 29.03,115.98 29.03,117.42 28.42,118.03 27.74,118.03 25.53,115.82 25.53,110.19 24.31,108.97 23.24,108.97 22.71,108.43 22.71,106.53 22.25,106.07 C3.2
  Top 0.254: U1.7 U1.8 C3.2
N$2
  Top 0.152: R1.1 32.46,109.96 32.46,111.18 29.49,114.15 J2.2
N$4
  Top 0.152: R3.1 26.75,109.88 26.75,114.15 J2.3
N$5
  Top 0.152: R2.2 29.57,109.96 29.57,112.7 28.12,114.15 28.12,116.97 J2.7
N$7
  Top 0.152: R5.1 20.95,109.88 20.95,111.18 23.93,114.15 J2.4
N$8
  Top 0.152: R6.1 18.29,109.88 18.29,111.25 21.18,114.15 J2.5
N$9
  Top 0.381: U5.28 28.93,103.5 C6.2
N$11
  Top 0.152: R4.2 23.85,109.96 23.85,112.7 25.22,114.07 25.22,116.89 25.3,116.97 J2.8
N$16
  Top 1.27: BAT2.2 6.48,34.02 6.48,54.99 2.79,58.67 2.79,62.14 BAT1.1
RX  (via drill 0.35)
  Top 0.152: v41.76,81.99 41.76,101.65 37.49,105.92 36.96,105.92 36.12,105.08 36.12,102.18 36.2,102.11 36.2,101.73 35.66,101.19 35.66,101.04 U5.17
  Bottom 0.152: v41.76,81.99 41.76,44.65 38.1,41 X2.1
SCK_5V
  Top 0.152: R3.2 26.75,108.2 28.19,108.2 28.96,108.97 30.25,108.97 31.93,107.29 31.93,102.95 29.49,100.51 29.11,100.51 28.65,100.97 U5.32
SCL_3V  (via drill 0.35)
  Top 0.152: v25.15,101.65 24.23,100.74 U1.4 | v32.03,92.18 32.33,92.18 34.21,90.3 35.28,90.3 35.97,89.61 R18.2 36.04,89.53 36.8,88.77 36.8,87.25 31.47,81.92 v30.71,81.92
  Bottom 0.152: v25.15,101.65 25.15,102.26 25.98,103.1 26.59,103.1 27.05,102.64 27.05,101.27 30.73,97.59 30.73,94.74 32.03,93.45 v32.03,92.18 | J3.3 26.67,82.53 27.28,81.92 v30.71,81.92
SCL_5V  (via drill 0.35)
  Top 0.152: 30.33,91.42 30.33,92.96 30.18,93.12 30.18,93.5 30.63,93.95 U5.47 | 30.33,91.42 30.33,90.3 30.02,89.99 29.95,89.99 29.57,89.61 R20.2 | v24.99,104.17 24.69,104.47 24.23,104.47 U1.5 | 30.33,91.42 28.75,91.42 v28.73,91.39
  Top 0.254: U1.5 24.16,107.88 R4.1
  Bottom 0.152: v24.99,104.17 24.99,102.56 24.54,102.11 24.54,101.35 28.12,97.77 29.64,97.77 29.95,97.46 29.95,93.75 28.73,92.53 v28.73,91.39
SDA_3V  (via drill 0.35)
  Top 0.152: v28.12,80.31 27.1,80.31 24,83.41 v22.86,83.41 | v34.9,88.62 34.82,88.62 33.91,89.53 R17.2 | U1.3 23.52,99.97 22.43,98.88 22.43,93.76 19.43,90.76 v19.43,90.75
  Bottom 0.152: v19.43,90.75 19.43,89.36 22.86,85.93 v22.86,83.41 | v28.12,80.31 28.12,80.09 29.18,79.02 J3.2 29.26,79.02 30.4,79.02 34.9,83.52 v34.9,88.62
SDA_5V  (via drill 0.35)
  Top 0.152: v31.24,91.14 31.7,90.68 31.7,89.61 R19.2 | v29.59,92.15 29.59,93.52 30.33,94.26 U5.46 | 26.29,103.5 v26.29,102.49
  Top 0.254: U1.6 23.52,103.87 23.88,103.5 26.29,103.5 26.8,103.5 29.46,106.17 29.46,108.04 R2.1
  Bottom 0.152: v31.24,91.14 30.61,91.14 v29.59,92.15 29.79,92.15 29.79,92.76 30.25,93.22 30.25,97.64 26.29,101.6 v26.29,102.49
SHIFT_EN
  Top 0.152: R16.1 35.28,104.62 34.98,104.62 33.53,103.17 U5.23
TX
  Top 0.152: U5.16 35.97,100.66 35.43,100.13 35.43,99.67 41.15,93.95 41.15,81.69 45.64,77.19 45.64,41 X2.4
UPDI  (via drill 0.35)
  Top 0.152: v29.34,97.16 29.34,97 28.65,96.32 28.65,96.09 U5.41
  Bottom 0.152: v29.34,97.16 29.34,93.6 24.16,88.42 24.16,82.37 11.43,69.65 X1.1
VBAT
  Top 0.762: J2.1 33.66,115.67 33.66,117.73 32.51,118.87 19.43,118.87 18.92,118.36 18.92,115.06 12.39,108.53 12.39,97.94 U2.3
  Top 1.27: BAT1.2 7.81,75 12.95,80.14 12.95,90.93 14.03,92.01 C1.1 13.53,93.91 U2.3